# EAGLE schematic receiver_2v0 (EAGLE 6.2)

## Sheet 1 of 4: RF
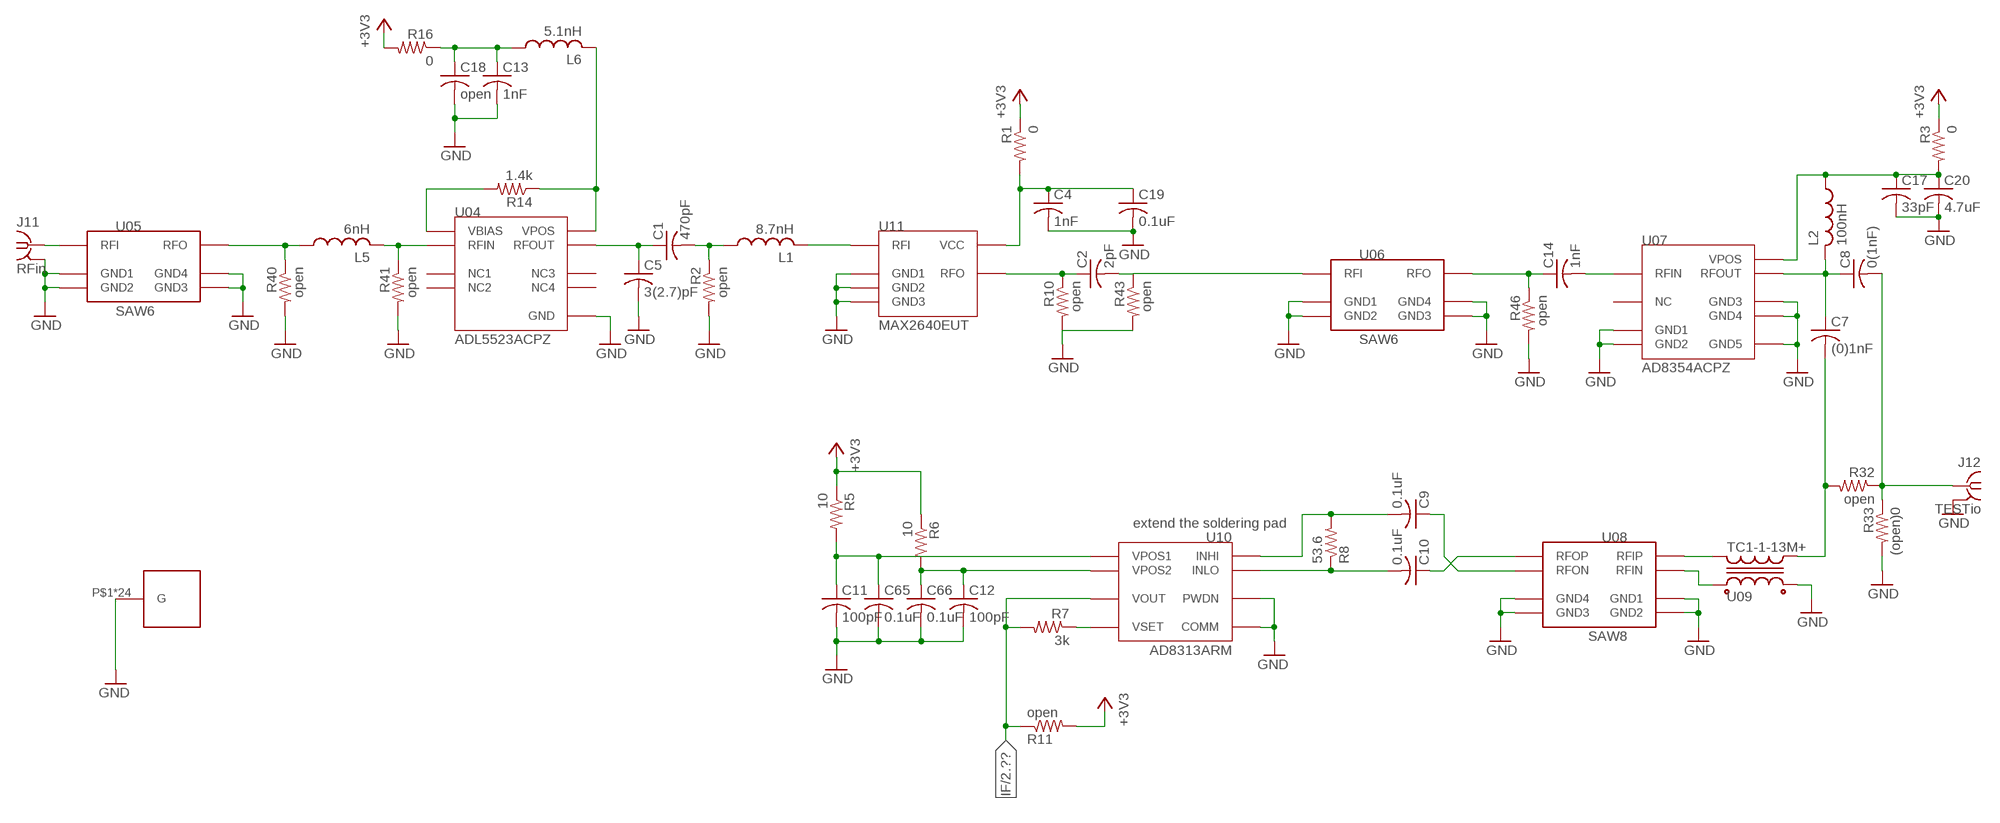
[diagram p0: schematic, sheet 1]

### Parts
C1  470pF  C-USC0603  [C0603]
C2  2pF  C-USC0603  [C0603]
C4  1nF  C-USC0603  [C0603]
C5  3(2.7)pF  C-USC0603  [C0603]
C7  (0)1nF  C-USC0603  [C0603]
C8  0(1nF)  C-USC0603  [C0603]
C9  0.1uF  C-USC0603  [C0603]
C10  0.1uF  C-USC0603  [C0603]
C11  100pF  C-USC0603  [C0603]
C12  100pF  C-USC0603  [C0603]
C13  1nF  C-USC0603  [C0603]
C14  1nF  C-USC0603  [C0603]
C17  33pF  C-USC0603  [C0603]
C18  open  C-USC0603  [C0603]
C19  0.1uF  C-USC0603  [C0603]
C20  4.7uF  C-USC0603  [C0603]
C65  0.1uF  C-USC0603  [C0603]
C66  0.1uF  C-USC0603  [C0603]
J11  RFin  SMA-142-0711-821/826  [J502-ND-142-0711-821/826]
J12  TESTio  SMA-142-0711-821/826  [J502-ND-142-0711-821/826]
L1  8.7nH  L-USL0603  [L0603]
L2  100nH  L-USL0603  [L0603]
L5  6nH  L-USL0603  [L0603]
L6  5.1nH  L-USL0603  [L0603]
R1  0  R-US_R0603  [R0603]
R2  open  R-US_R0603  [R0603]
R3  0  R-US_R0603  [R0603]
R5  10  R-US_R0603  [R0603]
R6  10  R-US_R0603  [R0603]
R7  3k  R-US_R0603  [R0603]
R8  53.6  R-US_R0603  [R0603]
R10  open  R-US_R0603  [R0603]
R11  open  R-US_R0603  [R0603]
R14  1.4k  R-US_R0603  [R0603]
R16  0  R-US_R0603  [R0603]
R32  open  R-US_R0603  [R0603]
R33  (open)0  R-US_R0603  [R0603]
R40  open  R-US_R0603  [R0603]
R41  open  R-US_R0603  [R0603]
R43  open  R-US_R0603  [R0603]
R46  open  R-US_R0603  [R0603]
U04  ADL5523ACPZ  [CP-8-2]
U05  SAW6  [SAW6]
U06  SAW6  [SAW6]
U07  AD8354ACPZ  [CP-8-1]
U08  SAW8  [SAW8]
U09  TC1-1-13M+  [AT224-1A]
U10  AD8313ARM  [RM-08]
U11  MAX2640EUT  [SOT23-6]
U$8  BMI-S-5  [BMI-S-105]

### Nets
+3V3: R1.1 R3.1 R5.1 R6.1 R11.2 R16.2 ; also sheet 2,4
GND: C4.2 C5.2 C11.2 C12.2 C13.2 C17.2 C18.2 C19.2 C20.2 C65.2 C66.2 J11.G@1(GND) J12.G@1(GND) R2.2 R10.2 R33.2 R40.2 R41.2 R43.2 R46.2 U04.9(GND) U05.A(GND1) U05.C(GND2) U05.D(GND3) U05.F(GND4) U06.A(GND1) U06.C(GND2) U06.D(GND3) U06.F(GND4) U07.1(GND1) U07.4(GND2) U07.5(GND3) U07.8(GND4) U07.9(GND5) U08.P3(GND1) U08.P4(GND2) U08.P7(GND3) U08.P8(GND4) U09.1(SD) U10.5(PWDN) U10.6(COMM) U11.2(GND1) U11.3(GND2) U11.5(GND3) U$8.P$1(G) U$8.P$2(G) U$8.P$3(G) U$8.P$4(G) U$8.P$5(G) U$8.P$6(G) U$8.P$7(G) U$8.P$8(G) U$8.P$9(G) U$8.P$10(G) U$8.P$11(G) U$8.P$12(G) U$8.P$13(G) U$8.P$15(G) U$8.P$16(G) U$8.P$17(G) U$8.P$18(G) U$8.P$20(G) U$8.P$21(G) U$8.P$22(G) U$8.P$23(G) U$8.P$24(G) U$8.P$25(G) U$8.P$26(G) ; also sheet 2,4
IF: R7.2 R11.1 U10.8(VOUT) ; also sheet 2
N$1: L1.2 U11.1(RFI)
N$3: C1.1 C5.1 U04.7(RFOUT)
N$4: C2.1 R10.1 U11.4(RFO)
N$5: C13.1 C18.1 L6.1 R16.1
N$6: C14.2 U07.3(RFIN)
N$7: J11.1 U05.B(RFI)
N$8: L6.2 R14.1 U04.8(VPOS)
N$10: C4.1 C19.1 R1.2 U11.6(VCC)
N$11: C17.1 C20.1 L2.1 R3.2 U07.6(VPOS)
N$14: C10.2 R8.1 U10.3(INLO)
N$15: C11.1 C65.1 R5.2 U10.1(VPOS1)
N$16: C12.1 C66.1 R6.2 U10.4(VPOS2)
N$17: C10.1 U08.P5(RFOP)
N$19: C9.1 U08.P6(RFON)
N$20: C9.2 R8.2 U10.2(INHI)
N$21: C7.1 C8.1 L2.2 U07.7(RFOUT)
N$22: C8.2 J12.1 R32.1 R33.1
N$23: U08.P1(RFIP) U09.4(P)
N$24: U08.P2(RFIN) U09.6(PD)
N$25: C14.1 R46.1 U06.E(RFO)
N$28: R14.2 U04.1(VBIAS)
N$29: L5.1 R40.1 U05.E(RFO)
N$30: L5.2 R41.1 U04.2(RFIN)
N$31: R7.1 U10.7(VSET)
N$32: C1.2 L1.1 R2.1
N$49: C2.2 R43.1 U06.B(RFI)
N$51: C7.2 R32.2 U09.3(S)
Unconnected: U04.3(NC1) U04.4(NC2) U04.5(NC3) U04.6(NC4) U07.2(NC)

### Notes on the sheet
- extend the soldering pad

## Sheet 2 of 4: digital
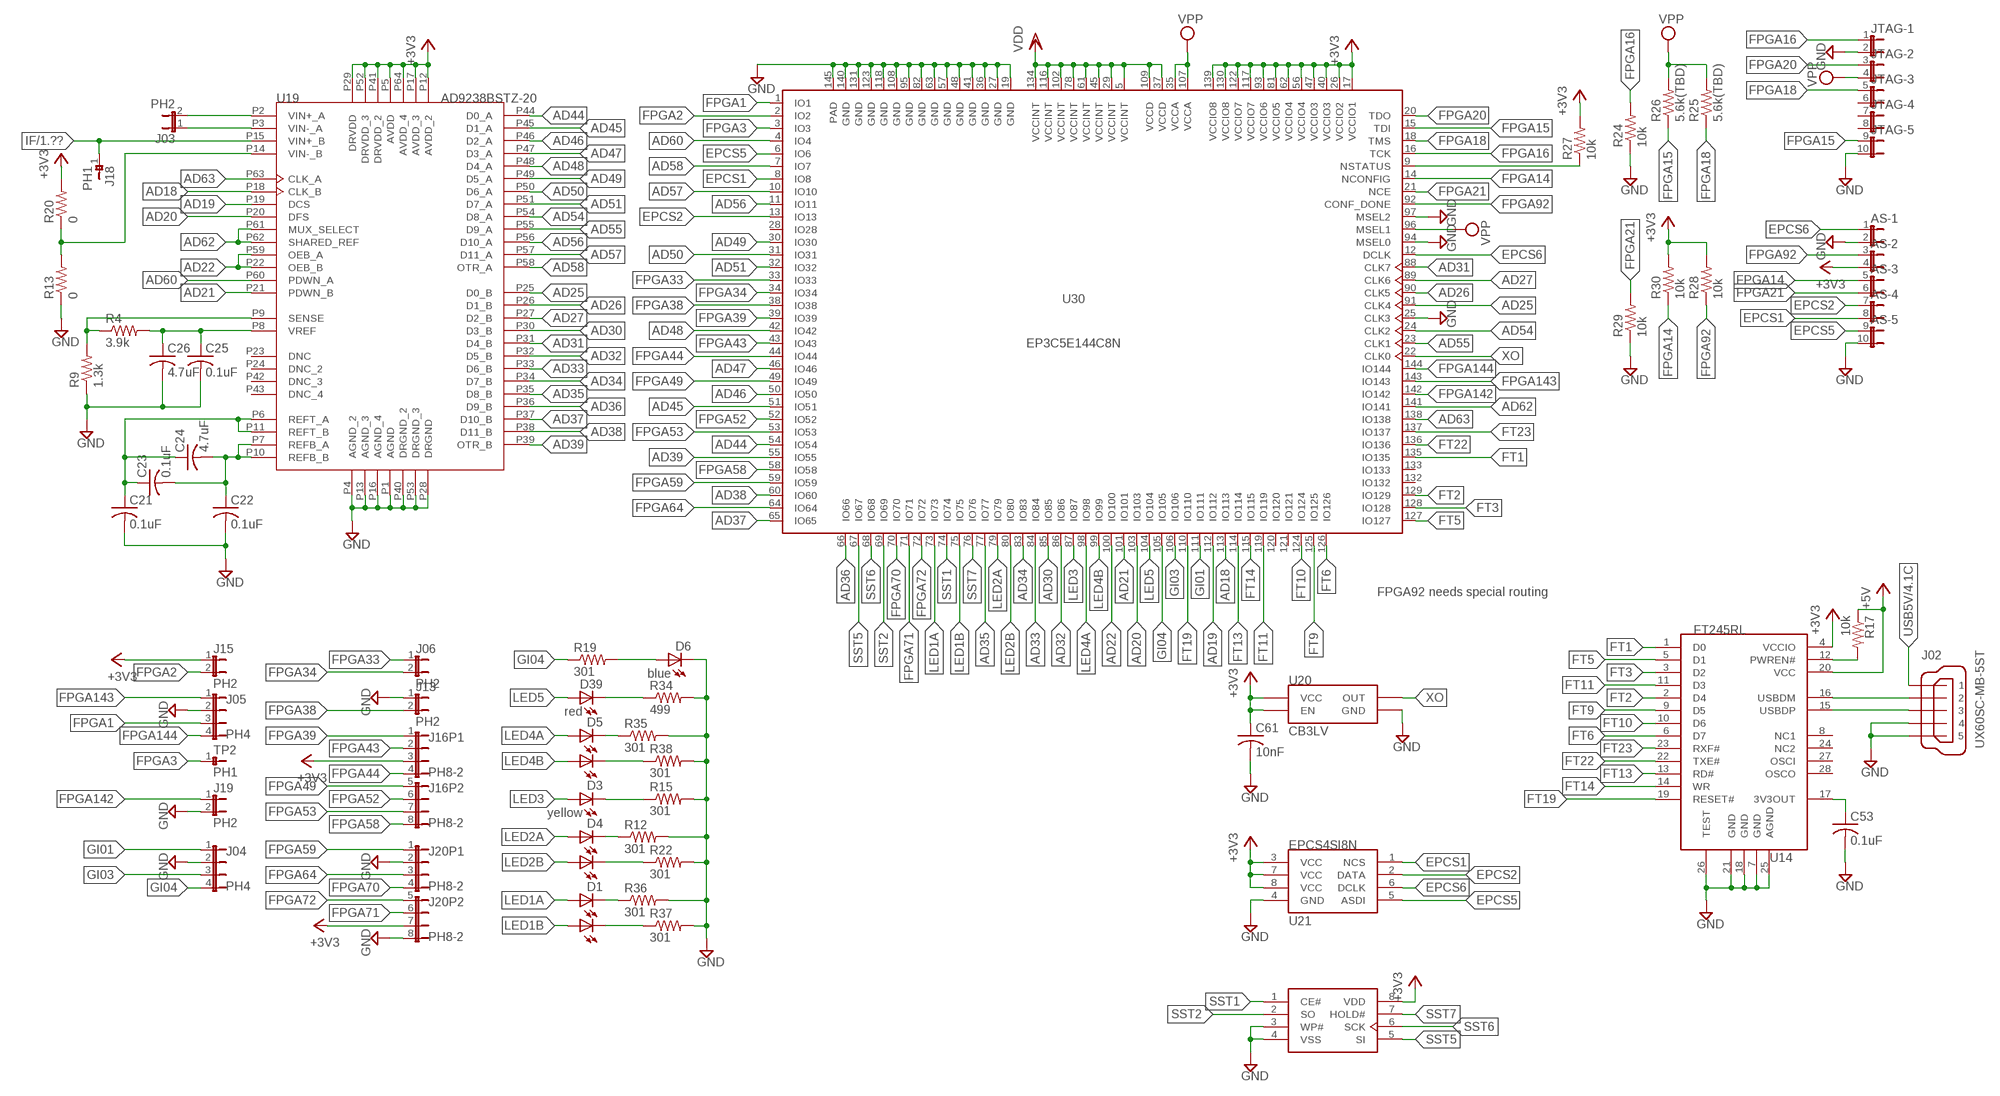
[diagram p1: schematic, sheet 2]

### Parts
AS  JP5QE  [JP5Q]
C21  0.1uF  C-USC0603  [C0603]
C22  0.1uF  C-USC0603  [C0603]
C23  0.1uF  C-USC0603  [C0603]
C24  4.7uF  C-USC0603  [C0603]
C25  0.1uF  C-USC0603  [C0603]
C26  4.7uF  C-USC0603  [C0603]
C53  0.1uF  C-USC0603  [C0603]
C61  10nF  C-USC0603  [C0603]
D1  LED0606  [LED0606]
D3  yellow  LED0603  [LED0603]
D4  LED0606  [LED0606]
D5  LED0606  [LED0606]
D6  blue  LED0603  [LED0603]
D39  red  LED0603  [LED0603]
J02  UX60SC-MB-5ST  [UX60SC-MB-5ST]
J03  PH2  [PH2]
J04  PH4  [PH4]
J05  PH4  [PH4]
J06  PH2  [PH2]
J13  PH2  [PH2]
J15  PH2  [PH2]
J16  PH8-2  [PH8-2]
J18  PH1  [PH1]
J19  PH2  [PH2]
J20  PH8-2  [PH8-2]
JTAG  JP5QE  [JP5Q]
R4  3.9k  R-US_R0603  [R0603]
R9  1.3k  R-US_R0603  [R0603]
R12  301  R-US_R0603  [R0603]
R13  0  R-US_R0603  [R0603]
R15  301  R-US_R0603  [R0603]
R17  10k  R-US_R0603  [R0603]
R19  301  R-US_R0603  [R0603]
R20  0  R-US_R0603  [R0603]
R22  301  R-US_R0603  [R0603]
R24  10k  R-US_R0603  [R0603]
R25  5.6k(TBD)  R-US_R0603  [R0603]
R26  5.6k(TBD)  R-US_R0603  [R0603]
R27  10k  R-US_R0603  [R0603]
R28  10k  R-US_R0603  [R0603]
R29  10k  R-US_R0603  [R0603]
R30  10k  R-US_R0603  [R0603]
R34  499  R-US_R0603  [R0603]
R35  301  R-US_R0603  [R0603]
R36  301  R-US_R0603  [R0603]
R37  301  R-US_R0603  [R0603]
R38  301  R-US_R0603  [R0603]
TP2  PH1  [PH1]
U14  FT245RL  [SSOP-28]
U19  AD9238BSTZ-20  [ST-64-1]
U20  CB3LV  [CB3]
U21  EPCS4SI8N  [SOIC-8]
U23  SST25VF512A-33-4C-SAE  [SOIC-8]
U30  EP3C5E144C8N  [EQFP144]

### Nets
+3V3: AS.4 C61.1 J15.1 J16.3 J20.7 R20.2 R27.2 R28.2 R30.2 U14.4(VCCIO) U19.P5(AVDD) U19.P12(AVDD_2) U19.P17(AVDD_3) U19.P29(DRVDD) U19.P41(DRVDD_2) U19.P52(DRVDD_3) U19.P64(AVDD_4) U20.1(EN) U20.4(VCC) U21.3(VCC) U21.7(VCC) U21.8(VCC) U23.8(VDD) U30.17(VCCIO1) U30.26(VCCIO2) U30.40(VCCIO3) U30.47(VCCIO3) U30.56(VCCIO4) U30.62(VCCIO4) U30.81(VCCIO5) U30.93(VCCIO6) U30.117(VCCIO7) U30.122(VCCIO7) U30.130(VCCIO8) U30.139(VCCIO8) ; also sheet 1,4
+5V: R17.1 U14.20(VCC) ; also sheet 4
AD18: U19.P18(CLK_B) U30.113(IO113)
AD19: U19.P19(DCS) U30.112(IO112)
AD20: U19.P20(DFS) U30.103(IO103)
AD21: U19.P21(PDWN_B) U30.101(IO101)
AD22: U19.P22(OEB_B) U19.P59(OEB_A) U30.100(IO100)
AD25: U19.P25(D0_B) U30.91(CLK4)
AD26: U19.P26(D1_B) U30.90(CLK5)
AD27: U19.P27(D2_B) U30.89(CLK6)
AD30: U19.P30(D3_B) U30.85(IO85)
AD31: U19.P31(D4_B) U30.88(CLK7)
AD32: U19.P32(D5_B) U30.86(IO86)
AD33: U19.P33(D6_B) U30.84(IO84)
AD34: U19.P34(D7_B) U30.83(IO83)
AD35: U19.P35(D8_B) U30.77(IO77)
AD36: U19.P36(D9_B) U30.66(IO66)
AD37: U19.P37(D10_B) U30.65(IO65)
AD38: U19.P38(D11_B) U30.60(IO60)
AD39: U19.P39(OTR_B) U30.55(IO55)
AD44: U19.P44(D0_A) U30.54(IO54)
AD45: U19.P45(D1_A) U30.51(IO51)
AD46: U19.P46(D2_A) U30.50(IO50)
AD47: U19.P47(D3_A) U30.46(IO46)
AD48: U19.P48(D4_A) U30.42(IO42)
AD49: U19.P49(D5_A) U30.30(IO30)
AD50: U19.P50(D6_A) U30.31(IO31)
AD51: U19.P51(D7_A) U30.32(IO32)
AD54: U19.P54(D8_A) U30.24(CLK2)
AD55: U19.P55(D9_A) U30.23(CLK1)
AD56: U19.P56(D10_A) U30.11(IO11)
AD57: U19.P57(D11_A) U30.10(IO10)
AD58: U19.P58(OTR_A) U30.7(IO7)
AD60: U19.P60(PDWN_A) U30.4(IO4)
AD62: U19.P61(MUX_SELECT) U19.P62(SHARED_REF) U30.141(IO141)
AD63: U19.P63(CLK_A) U30.138(IO138)
ADREFB: C22.1 C23.2 C24.2 U19.P7(REFB_A) U19.P10(REFB_B)
ADREFY: C21.1 C23.1 C24.1 U19.P6(REFT_A) U19.P11(REFT_B)
ADSENSE: R4.1 R9.2 U19.P9(SENSE)
ADVINMA: J03.1 U19.P3(VIN-_A)
ADVINMB: R13.2 R20.1 U19.P14(VIN-_B)
ADVINPA: J03.2 U19.P2(VIN+_A)
ADVREF: C25.1 C26.1 R4.2 U19.P8(VREF)
EPCS1: AS.8 U21.1(NCS) U30.8(IO8)
EPCS2: AS.7 U21.2(DATA) U30.13(IO13)
EPCS5: AS.9 U21.5(ASDI) U30.6(IO6)
EPCS6: AS.1 U21.6(DCLK) U30.12(DCLK)
FPGA1: J05.3 U30.1(IO1)
FPGA2: J15.2 U30.2(IO2)
FPGA3: TP2.1 U30.3(IO3)
FPGA9: R27.1 U30.9(NSTATUS)
FPGA14: AS.5 R30.1 U30.14(NCONFIG)
FPGA15: JTAG.9 R26.1 U30.15(TDI)
FPGA16: JTAG.1 R24.2 U30.16(TCK)
FPGA18: JTAG.5 R25.1 U30.18(TMS)
FPGA20: JTAG.3 U30.20(TDO)
FPGA21: AS.6 R29.2 U30.21(NCE)
FPGA33: J06.1 U30.33(IO33)
FPGA34: J06.2 U30.34(IO34)
FPGA38: J13.2 U30.38(IO38)
FPGA39: J16.1 U30.39(IO39)
FPGA43: J16.2 U30.43(IO43)
FPGA44: J16.4 U30.44(IO44)
FPGA49: J16.5 U30.49(IO49)
FPGA52: J16.6 U30.52(IO52)
FPGA53: J16.7 U30.53(IO53)
FPGA58: J16.8 U30.58(IO58)
FPGA59: J20.1 U30.59(IO59)
FPGA64: J20.3 U30.64(IO64)
FPGA70: J20.4 U30.70(IO70)
FPGA71: J20.6 U30.71(IO71)
FPGA72: J20.5 U30.72(IO72)
FPGA92: AS.3 R28.1 U30.92(CONF_DONE)
FPGA142: J19.1 U30.142(IO142)
FPGA143: J05.1 U30.143(IO143)
FPGA144: J05.4 U30.144(IO144)
FT1: U14.1(D0) U30.135(IO135)
FT2: U14.2(D4) U30.129(IO129)
FT3: U14.3(D2) U30.128(IO128)
FT5: U14.5(D1) U30.127(IO127)
FT6: U14.6(D7) U30.126(IO126)
FT9: U14.9(D5) U30.125(IO125)
FT10: U14.10(D6) U30.124(IO124)
FT11: U14.11(D3) U30.119(IO119)
FT12: R17.2 U14.12(PWREN#)
FT13: U14.13(RD#) U30.114(IO114)
FT14: U14.14(WR) U30.115(IO115)
FT19: U14.19(RESET#) U30.110(IO110)
FT22: U14.22(TXE#) U30.136(IO136)
FT23: U14.23(RXF#) U30.137(IO137)
GI01: J04.1 U30.111(IO111)
GI03: J04.3 U30.106(IO106)
GI04: J04.4 R19.1 U30.105(IO105)
GND: AS.2 AS.10 C21.2 C22.2 C25.2 C26.2 C53.2 C61.2 D6.C J02.4 J02.5 J04.2 J05.2 J13.1 J19.2 J20.2 J20.8 JTAG.2 JTAG.10 R9.1 R12.2 R13.1 R15.2 R22.2 R24.1 R29.1 R34.2 R35.2 R36.2 R37.2 R38.2 U14.7(GND) U14.18(GND) U14.21(GND) U14.25(AGND) U14.26(TEST) U19.P1(AGND) U19.P4(AGND_2) U19.P13(AGND_3) U19.P16(AGND_4) U19.P28(DRGND) U19.P40(DRGND_2) U19.P53(DRGND_3) U20.2(GND) U21.4(GND) U23.3(WP#) U23.4(VSS) U30.19(GND) U30.25(CLK3) U30.27(GND) U30.36(GND) U30.41(GND) U30.48(GND) U30.57(GND) U30.63(GND) U30.82(GND) U30.94(MSEL0) U30.95(GND) U30.97(MSEL2) U30.108(GND) U30.118(GND) U30.123(GND) U30.131(GND) U30.140(GND) U30.145(PAD) ; also sheet 1,4
IF: J18.1 U19.P15(VIN+_B) ; also sheet 1
LED1A: D1.A1 U30.73(IO73)
LED1B: D1.A0 U30.75(IO75)
LED2A: D4.A1 U30.79(IO79)
LED2B: D4.A0 U30.80(IO80)
LED3: D3.A U30.87(IO87)
LED4A: D5.A1 U30.98(IO98)
LED4B: D5.A0 U30.99(IO99)
LED5: D39.A U30.104(IO104)
N$2: C53.1 U14.17(3V3OUT)
N$9: D4.C1 R12.1
N$12: D39.C R34.1
N$13: D6.A R19.2
N$18: D3.C R15.1
N$38: D1.C1 R36.1
N$39: D4.C0 R22.1
N$40: D5.C1 R35.1
N$41: D1.C0 R37.1
N$44: D5.C0 R38.1
SST1: U23.1(CE#) U30.74(IO74)
SST2: U23.2(SO) U30.69(IO69)
SST5: U23.5(SI) U30.67(IO67)
SST6: U23.6(SCK) U30.68(IO68)
SST7: U23.7(HOLD#) U30.76(IO76)
USB5V: J02.1 ; also sheet 4
USBDM: J02.2 U14.16(USBDM)
USBDP: J02.3 U14.15(USBDP)
VDD: U30.5(VCCINT) U30.29(VCCINT) U30.37(VCCD) U30.45(VCCINT) U30.61(VCCINT) U30.78(VCCINT) U30.102(VCCINT) U30.109(VCCD) U30.116(VCCINT) U30.134(VCCINT) ; also sheet 4
VPP: JTAG.4 R25.2 R26.2 U30.35(VCCA) U30.96(MSEL1) U30.107(VCCA) ; also sheet 4
XO: U20.3(OUT) U30.22(CLK0)
Unconnected: JTAG.6 JTAG.7 JTAG.8 U14.8(NC1) U14.24(NC2) U14.27(OSCI) U14.28(OSCO) U19.P23(DNC) U19.P24(DNC_2) U19.P42(DNC_3) U19.P43(DNC_4) U30.28(IO28) U30.120(IO120) U30.121(IO121) U30.132(IO132) U30.133(IO133)

### Notes on the sheet
- FPGA92 needs special routing

## Sheet 3 of 4: FPGA

## Sheet 4 of 4: power
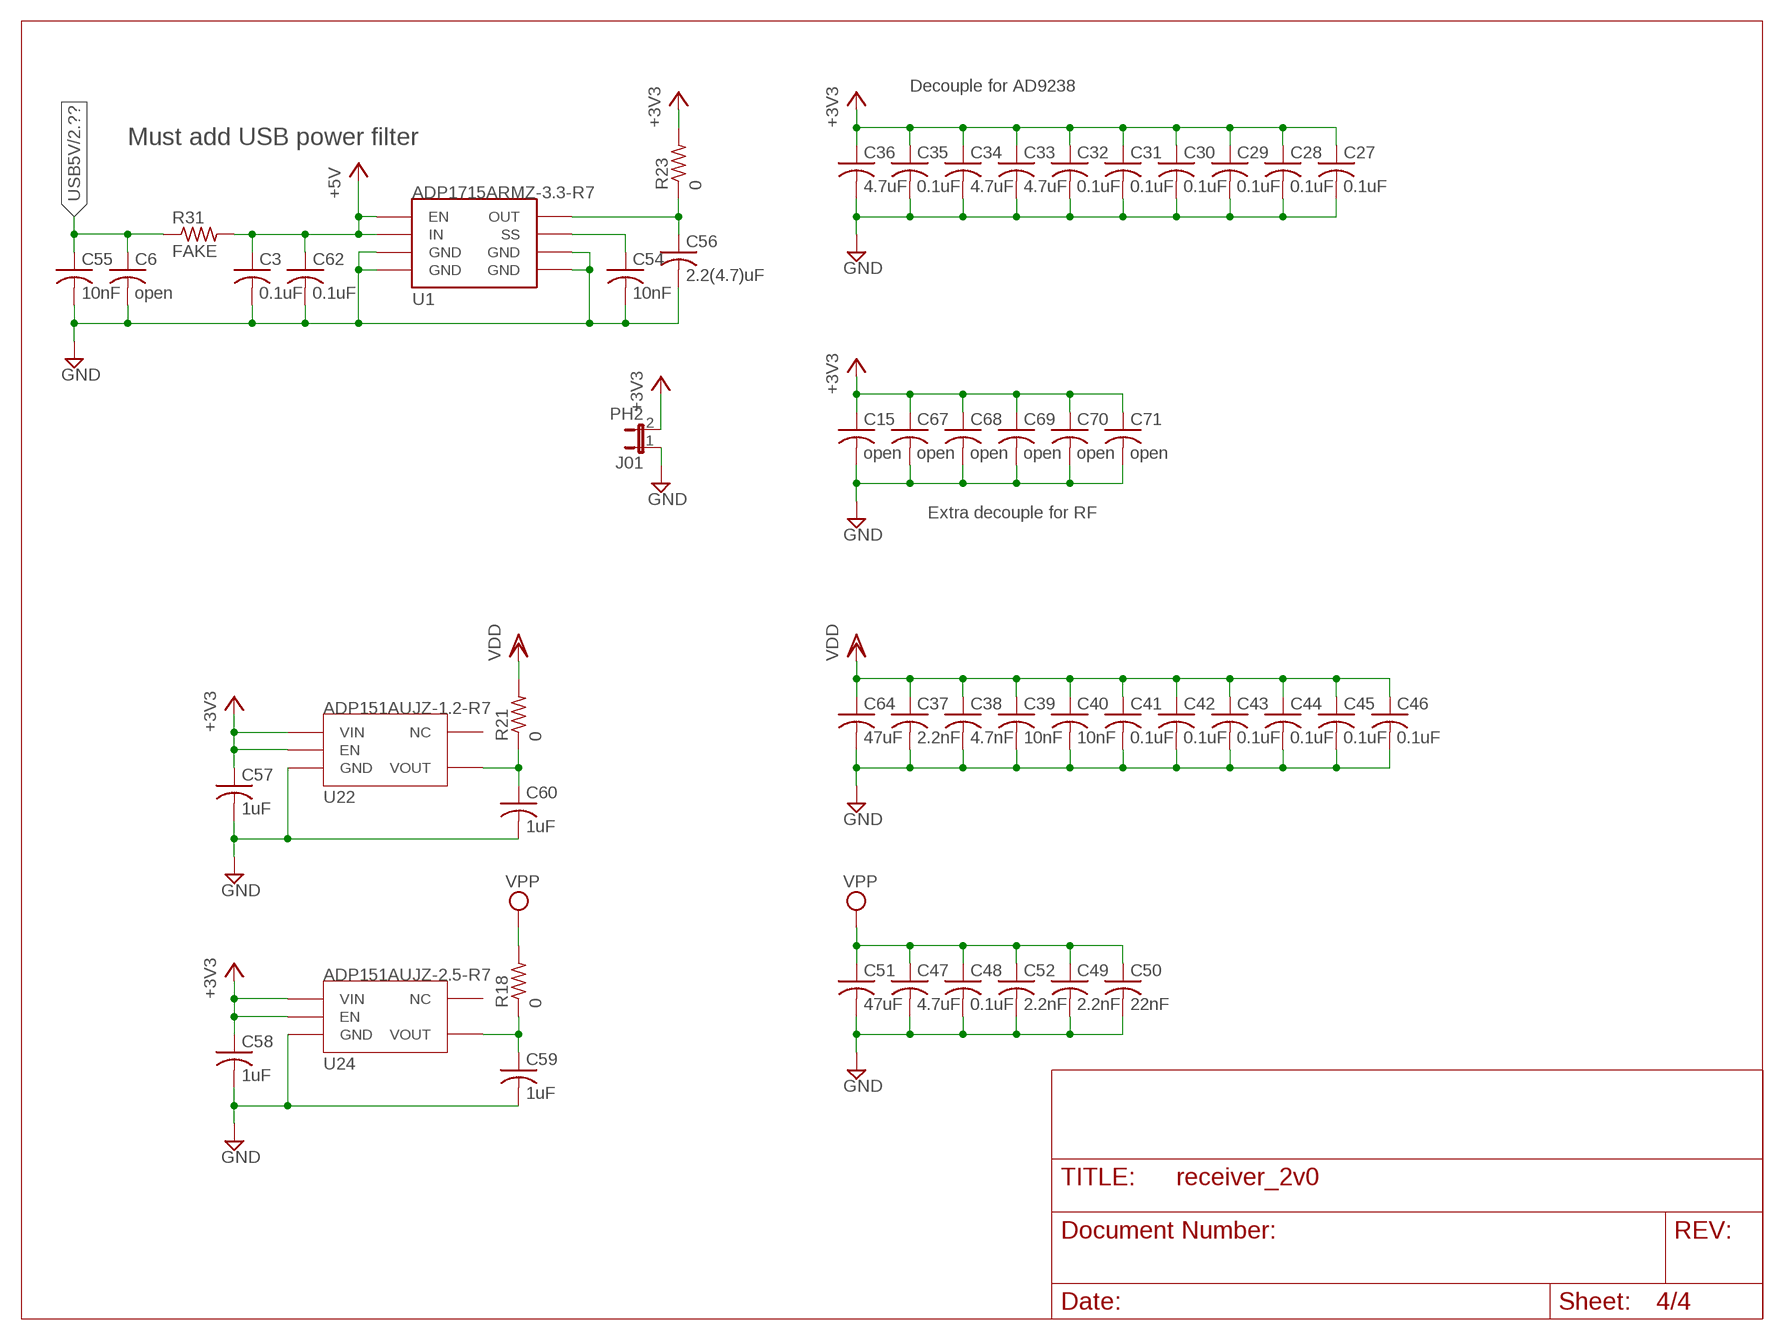
[diagram p2: schematic, sheet 4]

### Parts
C3  0.1uF  C-USC0603  [C0603]
C6  open  C-USC0603  [C0603]
C15  open  C-USC0603  [C0603]
C27  0.1uF  C-USC0603  [C0603]
C28  0.1uF  C-USC0603  [C0603]
C29  0.1uF  C-USC0603  [C0603]
C30  0.1uF  C-USC0603  [C0603]
C31  0.1uF  C-USC0603  [C0603]
C32  0.1uF  C-USC0603  [C0603]
C33  4.7uF  C-USC0603  [C0603]
C34  4.7uF  C-USC0603  [C0603]
C35  0.1uF  C-USC0603  [C0603]
C36  4.7uF  C-USC0603  [C0603]
C37  2.2nF  C-USC0603  [C0603]
C38  4.7nF  C-USC0603  [C0603]
C39  10nF  C-USC0603  [C0603]
C40  10nF  C-USC0603  [C0603]
C41  0.1uF  C-USC0603  [C0603]
C42  0.1uF  C-USC0603  [C0603]
C43  0.1uF  C-USC0603  [C0603]
C44  0.1uF  C-USC0603  [C0603]
C45  0.1uF  C-USC0603  [C0603]
C46  0.1uF  C-USC0603  [C0603]
C47  4.7uF  C-USC0603  [C0603]
C48  0.1uF  C-USC0603  [C0603]
C49  2.2nF  C-USC0603  [C0603]
C50  22nF  C-USC0603  [C0603]
C51  47uF  C-USC1206  [C1206]
C52  2.2nF  C-USC0603  [C0603]
C54  10nF  C-USC0603  [C0603]
C55  10nF  C-USC0603  [C0603]
C56  2.2(4.7)uF  C-USC0603  [C0603]
C57  1uF  C-USC0603  [C0603]
C58  1uF  C-USC0603  [C0603]
C59  1uF  C-USC0603  [C0603]
C60  1uF  C-USC0603  [C0603]
C62  0.1uF  C-USC0603  [C0603]
C64  47uF  C-USC1206  [C1206]
C67  open  C-USC0603  [C0603]
C68  open  C-USC0603  [C0603]
C69  open  C-USC0603  [C0603]
C70  open  C-USC0603  [C0603]
C71  open  C-USC0603  [C0603]
J01  PH2  [PH2]
R18  0  R-US_R0603  [R0603]
R21  0  R-US_R0603  [R0603]
R23  0  R-US_R0603  [R0603]
R31  FAKE  R-US_R0603  [R0603]
U1  ADP1715ARMZ-3.3-R7  [RM-08]
U22  ADP151AUJZ-1.2-R7  [UJ-5]
U24  ADP151AUJZ-2.5-R7  [UJ-5]

### Nets
+3V3: C15.1 C27.1 C28.1 C29.1 C30.1 C31.1 C32.1 C33.1 C34.1 C35.1 C36.1 C57.1 C58.1 C67.1 C68.1 C69.1 C70.1 C71.1 J01.2 R23.2 U22.1(VIN) U22.3(EN) U24.1(VIN) U24.3(EN) ; also sheet 1,2
+5V: C3.1 C62.1 R31.2 U1.1(EN) U1.2(IN) ; also sheet 2
ADP1715_3: C56.1 R23.1 U1.3(OUT)
GND: C3.2 C6.2 C15.2 C27.2 C28.2 C29.2 C30.2 C31.2 C32.2 C33.2 C34.2 C35.2 C36.2 C37.2 C38.2 C39.2 C40.2 C41.2 C42.2 C43.2 C44.2 C45.2 C46.2 C47.2 C48.2 C49.2 C50.2 C51.2 C52.2 C54.2 C55.2 C56.2 C57.2 C58.2 C59.2 C60.2 C62.2 C64.2 C67.2 C68.2 C69.2 C70.2 C71.2 J01.1 U1.5(GND) U1.6(GND) U1.7(GND) U1.8(GND) U22.2(GND) U24.2(GND) ; also sheet 1,2
N$26: C60.1 R21.1 U22.5(VOUT)
N$42: C59.1 R18.1 U24.5(VOUT)
N$43: C54.1 U1.4(SS)
USB5V: C6.1 C55.1 R31.1 ; also sheet 2
VDD: C37.1 C38.1 C39.1 C40.1 C41.1 C42.1 C43.1 C44.1 C45.1 C46.1 C64.1 R21.2 ; also sheet 2
VPP: C47.1 C48.1 C49.1 C50.1 C51.1 C52.1 R18.2 ; also sheet 2
Unconnected: U22.4(NC) U24.4(NC)

### Notes on the sheet
- Decouple for AD9238
- Must add USB power filter
- Extra decouple for RF

## Power pins joined to a net without a drawn wire
GND: J11.G@2(GND) J11.G@3(GND) J11.G@4(GND) J12.G@2(GND) J12.G@3(GND) J12.G@4(GND)

## Library data of the parts
AS JTAG = jumper:JP5QE: JUMPER
C1-C15 C17-C62 C64-C71 = rcl:C-US: CAPACITOR, American symbol
D1 D4 D5 = receiver_2v0:LED0606
D3 D6 D39 = receiver_2v0:LED0603
J01 J03 J06 J13 J15 J19 = receiver_2v0:PH2
J02 = receiver_2v0:UX60SC-MB-5ST
J04 J05 = receiver_2v0:PH4
J11 J12 = con-coax:SMA-: SMA 50 Ohm End Launch Jack Receptacle - Round Contact Johnson Components Source: www.johnsoncomponents.com .. J502-ND.pdf; MF: JOHNSON COMPONENTS; MPN: 142-0711-821; OC_FARNELL: 1019328; OC_NEWARK: 16F3627
J16 J20 = receiver_2v0:PH8-2
J18 TP2 = receiver_2v0:PH1
L1 L2 L5 L6 = rcl-dz1:L-US: INDUCTOR, American symbol
R1-R38 R40 R41 R43 R46 = rcl:R-US_: RESISTOR, American symbol
U1 = receiver_2v0:ADP1715ARMZ-3.3-R7
U04 = receiver_2v0:ADL5523ACPZ
U05 U06 = receiver_2v0:SAW6
U07 = receiver_2v0:AD8354ACPZ
U08 = receiver_2v0:SAW8
U09 = receiver_2v0:TC1-1-13M+
U10 = receiver_2v0:AD8313ARM
U11 = receiver_2v0:MAX2640EUT
U14 = receiver_2v0:FT245RL
U19 = receiver_2v0:AD9238BSTZ-20; MANUFACTURER_PART_NUMBER: AD9238BSTZ-20; VENDOR: Vendor
U20 = receiver_2v0:CB3LV
U21 = receiver_2v0:EPCS4SI8N
U22 = receiver_2v0:ADP151AUJZ-1.2-R7
U23 = receiver_2v0:SST25VF512A-33-4C-SAE
U24 = receiver_2v0:ADP151AUJZ-2.5-R7
U30 = receiver_2v0:EP3C5E144C8N: ep3c5e144 edit this description Auto generated by make-symbol-device-package-bsdl.ulp Rev. 43 Source: ep3c5e144.txt
U$8 = dzhang:BMI-S-5